# EAGLE design laser-simple (EAGLE 7.2.0)
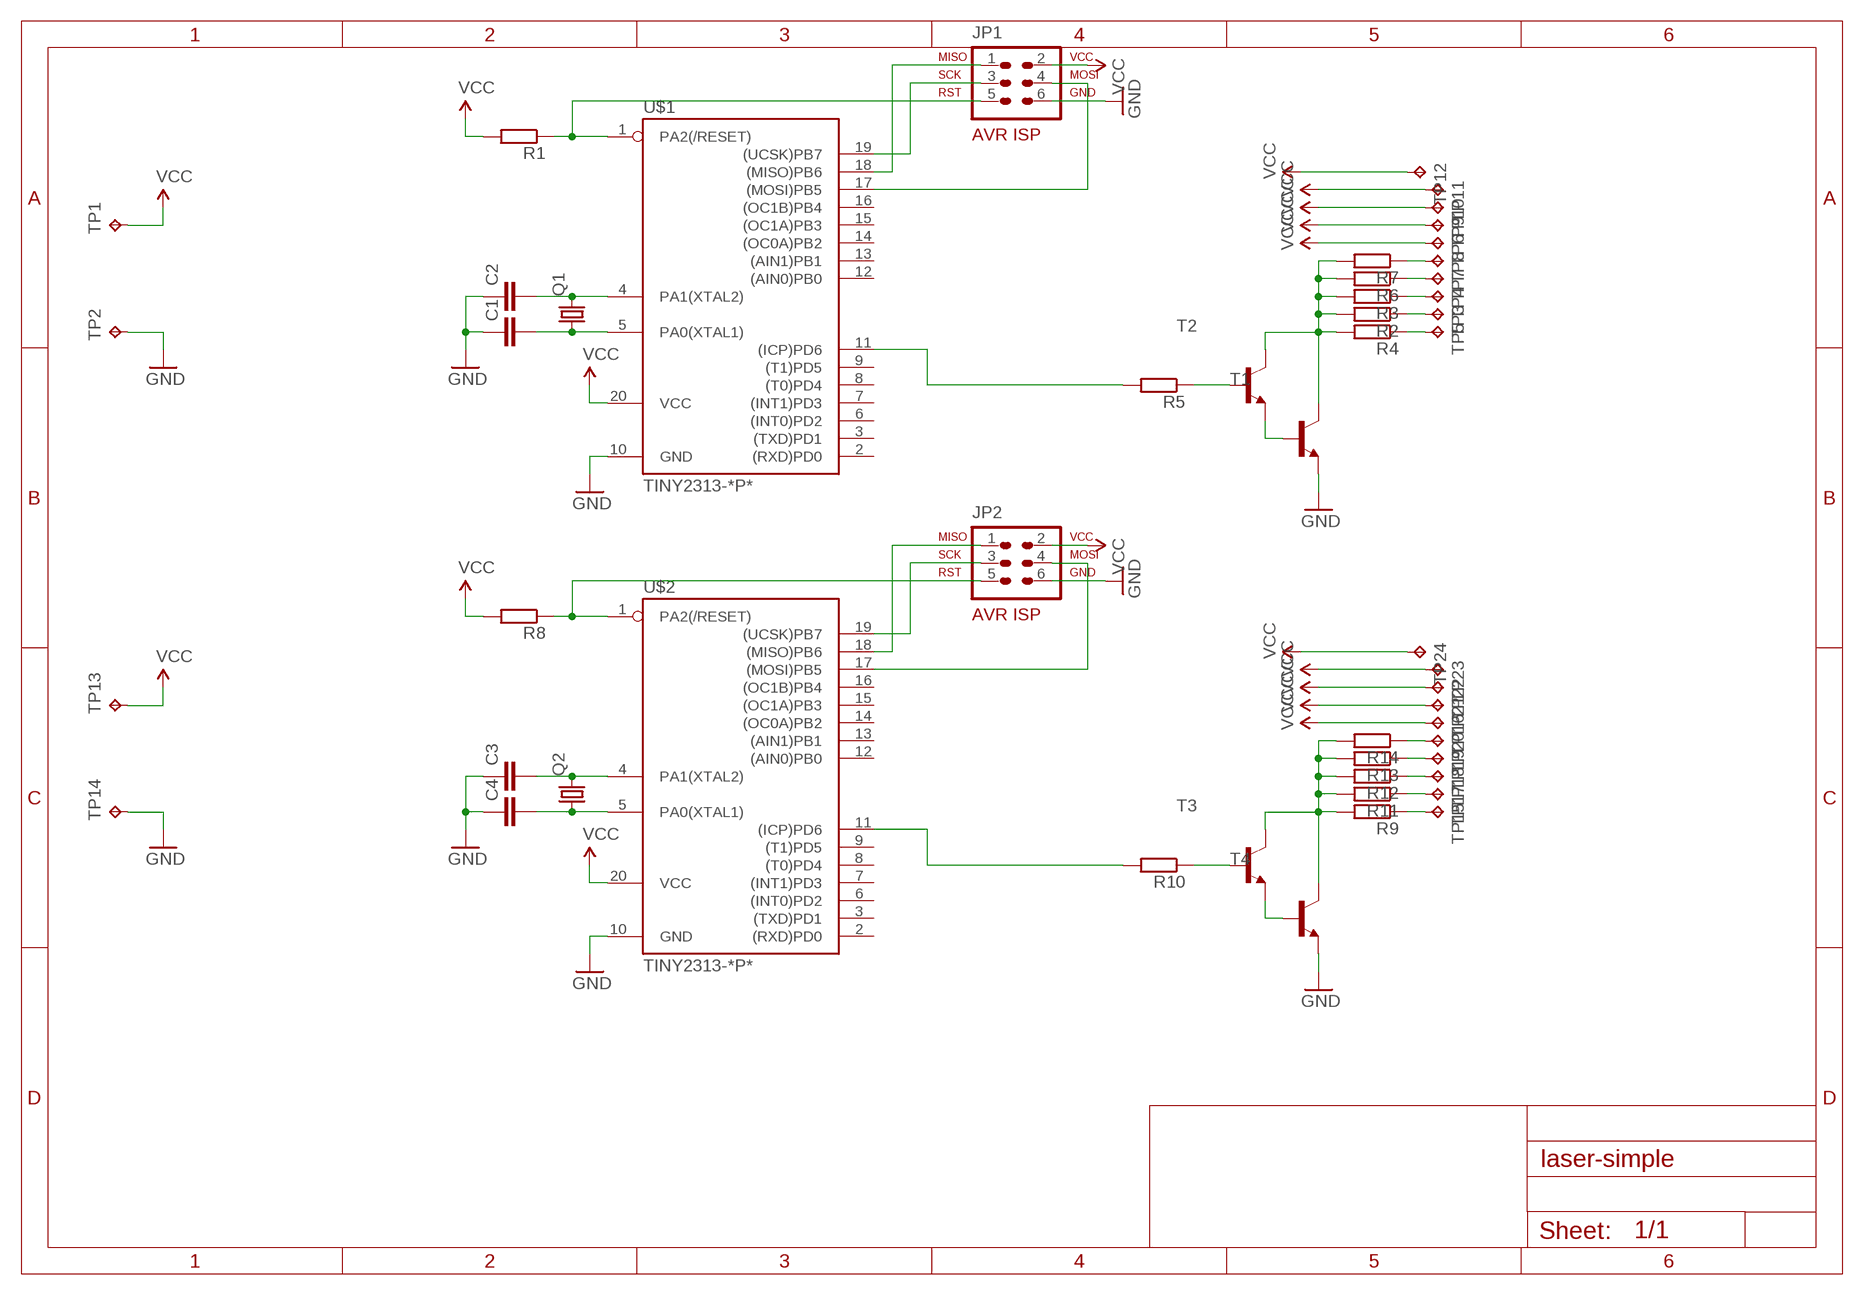
[diagram p0: schematic, sheet 1]

## Parts
C1  C-EU050-024X044  [C050-024X044]
C2  C-EU050-024X044  [C050-024X044]
C3  C-EU050-024X044  [C050-024X044]
C4  C-EU050-024X044  [C050-024X044]
JP1  AVR-ISP-6VERT  [AVR-ISP-6]
JP2  AVR-ISP-6VERT  [AVR-ISP-6]
Q1  CRYSTALHC49U-V  [HC49U-V]
Q2  CRYSTALHC49U-V  [HC49U-V]
R1  R-EU_0207/10  [0207/10]
R2  R-EU_0207/10  [0207/10]
R3  R-EU_0207/10  [0207/10]
R4  R-EU_0207/10  [0207/10]
R5  R-EU_0207/10  [0207/10]
R6  R-EU_0207/10  [0207/10]
R7  R-EU_0207/10  [0207/10]
R8  R-EU_0207/10  [0207/10]
R9  R-EU_0207/10  [0207/10]
R10  R-EU_0207/10  [0207/10]
R11  R-EU_0207/10  [0207/10]
R12  R-EU_0207/10  [0207/10]
R13  R-EU_0207/10  [0207/10]
R14  R-EU_0207/10  [0207/10]
T1  2N1711-NPN-TO39-EBC  [TO39]
T2  2N1711-NPN-TO39-EBC  [TO39]
T3  2N1711-NPN-TO39-EBC  [TO39]
T4  2N1711-NPN-TO39-EBC  [TO39]
TP1  TPPAD1-13Y  [P1-13Y]
TP2  TPPAD1-13Y  [P1-13Y]
TP3  TPPAD1-13Y  [P1-13Y]
TP4  TPPAD1-13Y  [P1-13Y]
TP5  TPPAD1-13Y  [P1-13Y]
TP6  TPPAD1-13Y  [P1-13Y]
TP7  TPPAD1-13Y  [P1-13Y]
TP8  TPPAD1-13Y  [P1-13Y]
TP9  TPPAD1-13Y  [P1-13Y]
TP10  TPPAD1-13Y  [P1-13Y]
TP11  TPPAD1-13Y  [P1-13Y]
TP12  TPPAD1-13Y  [P1-13Y]
TP13  TPPAD1-13Y  [P1-13Y]
TP14  TPPAD1-13Y  [P1-13Y]
TP15  TPPAD1-13Y  [P1-13Y]
TP16  TPPAD1-13Y  [P1-13Y]
TP17  TPPAD1-13Y  [P1-13Y]
TP18  TPPAD1-13Y  [P1-13Y]
TP19  TPPAD1-13Y  [P1-13Y]
TP20  TPPAD1-13Y  [P1-13Y]
TP21  TPPAD1-13Y  [P1-13Y]
TP22  TPPAD1-13Y  [P1-13Y]
TP23  TPPAD1-13Y  [P1-13Y]
TP24  TPPAD1-13Y  [P1-13Y]
U$1  TINY2313-*P*  [DIL20]
U$2  TINY2313-*P*  [DIL20]

## Nets
GND: C1.1 C2.1 C3.1 C4.1 JP1.6 JP2.6 T1.1(E) T4.1(E) TP2.TP TP14.TP U$1.10(GND) U$2.10(GND)
N$1: C2.2 Q1.2 U$1.4(PA1(XTAL2))
N$2: C1.2 Q1.1 U$1.5(PA0(XTAL1))
N$3: JP1.5 R1.1 U$1.1(PA2(/RESET))
N$4: JP1.1 U$1.18((MISO)PB6)
N$5: JP1.3 U$1.19((UCSK)PB7)
N$6: JP1.4 U$1.17((MOSI)PB5)
N$7: T1.2(B) T2.1(E)
N$8: R2.2 R3.2 R4.2 R6.2 R7.2 T1.3(C) T2.3(C)
N$9: R4.1 TP5.TP
N$10: R6.1 TP7.TP
N$11: R3.1 TP4.TP
N$12: R2.1 TP3.TP
N$13: C3.2 Q2.2 U$2.4(PA1(XTAL2))
N$14: R7.1 TP8.TP
N$15: C4.2 Q2.1 U$2.5(PA0(XTAL1))
N$16: R5.1 T2.2(B)
N$17: JP2.5 R8.1 U$2.1(PA2(/RESET))
N$18: JP2.1 U$2.18((MISO)PB6)
N$19: JP2.3 U$2.19((UCSK)PB7)
N$20: JP2.4 U$2.17((MOSI)PB5)
N$21: R5.2 U$1.11((ICP)PD6)
N$22: R9.1 TP15.TP
N$23: R10.1 T3.2(B)
N$24: R10.2 U$2.11((ICP)PD6)
N$25: T3.1(E) T4.2(B)
N$26: R9.2 R11.2 R12.2 R13.2 R14.2 T3.3(C) T4.3(C)
N$27: R13.1 TP19.TP
N$28: R12.1 TP18.TP
N$29: R11.1 TP17.TP
N$30: R14.1 TP20.TP
VCC: JP1.2 JP2.2 R1.2 R8.2 TP1.TP TP6.TP TP9.TP TP10.TP TP11.TP TP12.TP TP13.TP TP16.TP TP21.TP TP22.TP TP23.TP TP24.TP U$1.20(VCC) U$2.20(VCC)
Unconnected: U$1.2((RXD)PD0) U$1.3((TXD)PD1) U$1.6((INT0)PD2) U$1.7((INT1)PD3) U$1.8((T0)PD4) U$1.9((T1)PD5) U$1.12((AIN0)PB0) U$1.13((AIN1)PB1) U$1.14((OC0A)PB2) U$1.15((OC1A)PB3) U$1.16((OC1B)PB4) U$2.2((RXD)PD0) U$2.3((TXD)PD1) U$2.6((INT0)PD2) U$2.7((INT1)PD3) U$2.8((T0)PD4) U$2.9((T1)PD5) U$2.12((AIN0)PB0) U$2.13((AIN1)PB1) U$2.14((OC0A)PB2) U$2.15((OC1A)PB3) U$2.16((OC1B)PB4)

## Library data of the parts
C1-C4 = resistor:C-EU: CAPACITOR, European symbol
JP1 JP2 = avr-7:AVR-ISP-6: AVR ISP-6 Serial Programming Header
Q1 Q2 = crystal:CRYSTAL: CRYSTAL; OC_FARNELL: 1666969; OC_NEWARK: unknown
R1-R14 = resistor:R-EU_: RESISTOR, European symbol
T1-T4 = transistor:*-NPN-: NPN Transistror BF959 corrected 2008.03.06
TP1-TP24 = testpad:TP: Test pad
U$1 U$2 = avr-7:TINY2313*: Atmel Tiny2313 2K Flash, 128 bytes EEPROM, 128 bytes RAM

## Board
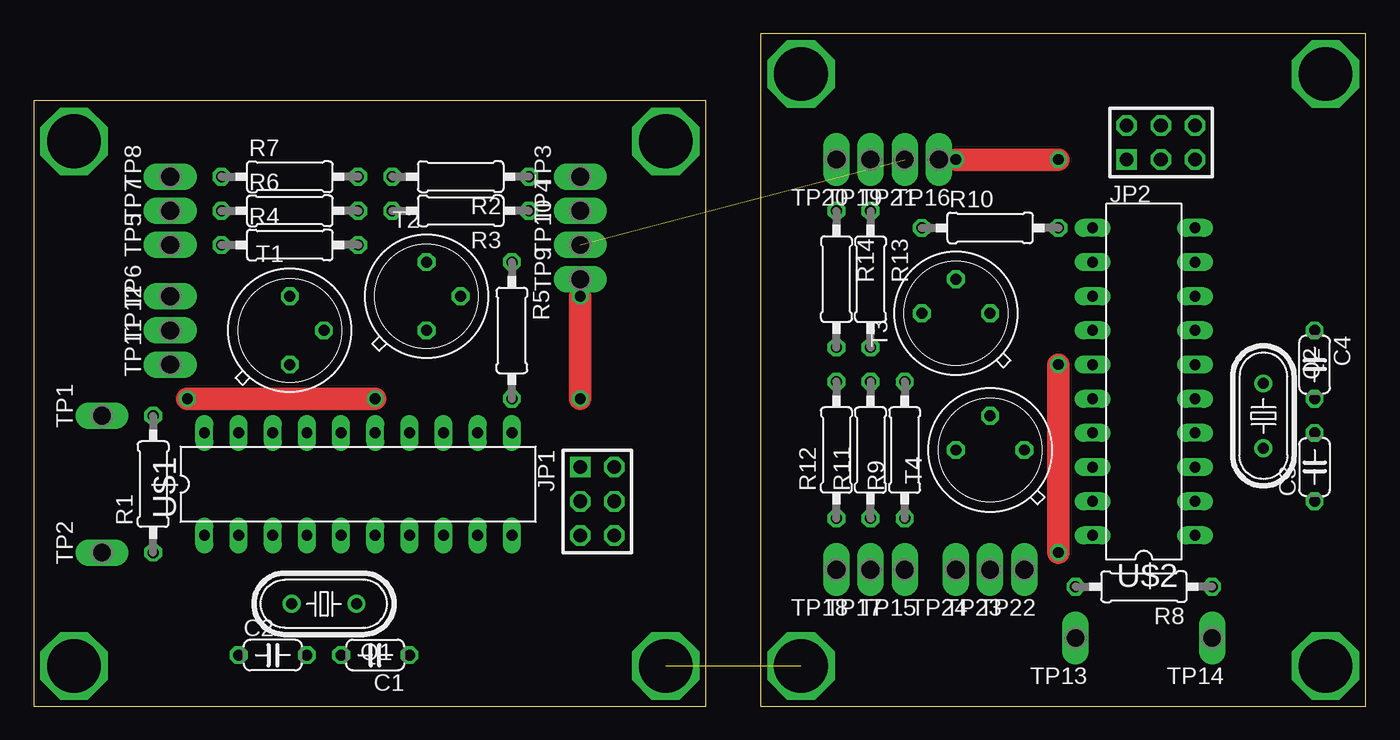
[diagram p1: board, top side]
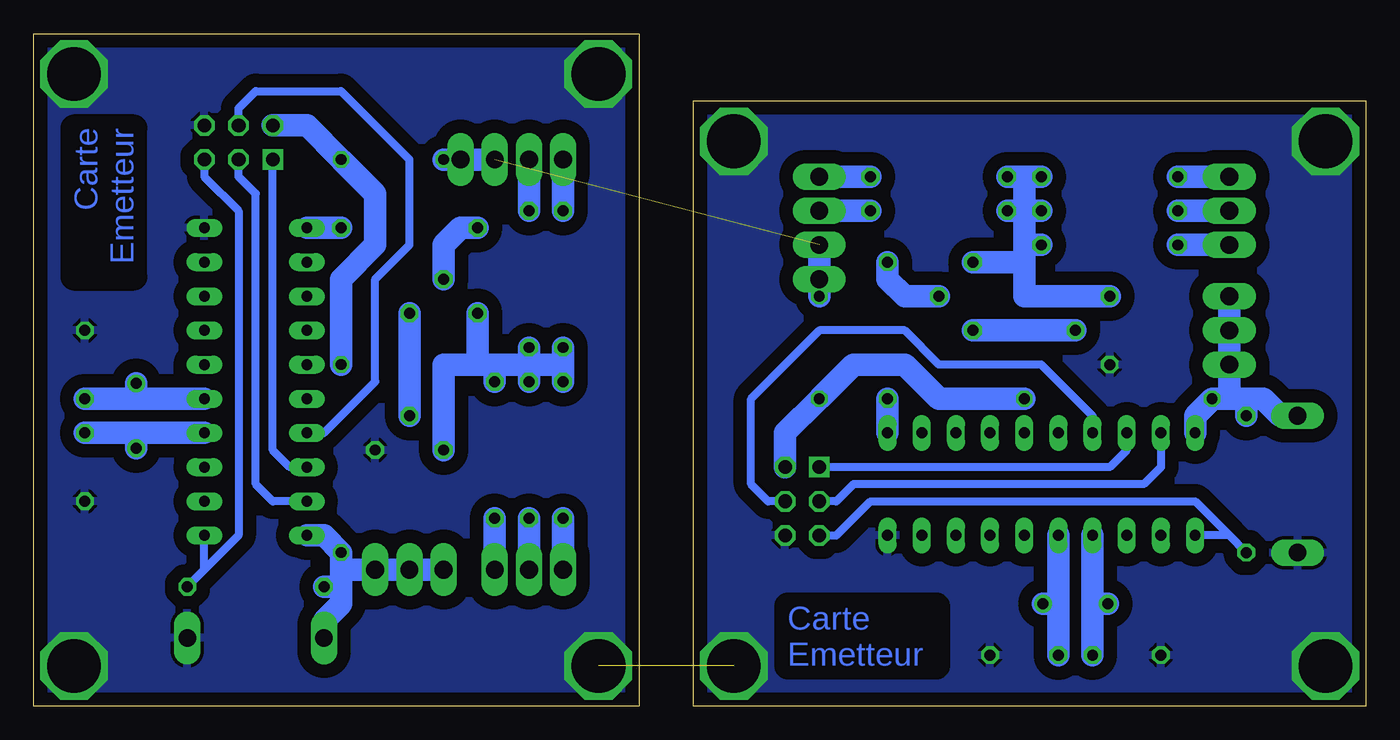
[diagram p2: board, bottom side, seen from below]

Size 99.06 x 50 mm. Coordinates in mm from the lower left corner, seen from the top.
Outline: 0,0 50,0 50,45 0,45 0,0
Outline: 99.06,0 99.06,50 54.06,50 54.06,0 99.06,0
Copper layers (1*16): Top 0.035mm / dielectric 1.5mm / Bottom 0.035mm
Design rules "default": minimum track width 10mil, minimum drill 24mil, track to track 8mil, track to pad 8mil, pad to pad 8mil, via to via 8mil, smd to smd 8mil, copper to edge 40mil, drill to drill 8mil, minimum pad ring 10mil, minimum via ring 8mil, stop-mask expansion 4mil, vias tented up to drill 0mil, thermal gap 10mil

### Footprints (pad centres in the part's own frame; a part is rotated, then mirrored left to right if it is on the bottom)
C050-024X044 = drill 0.813 octagon: 1 -2.54,0; 2 2.54,0
AVR-ISP-6 = drill 1.016 square: 1 -2.54,-1.27 | drill 1.016 octagon: 2 -2.54,1.27; 3 0,-1.27; 4 0,1.27; 5 2.54,-1.27; 6 2.54,1.27
HC49U-V = drill 0.813: 1 -2.413,0; 2 2.413,0
0207/10 = drill 0.813 octagon: 1 -5.08,0; 2 5.08,0
TO39 = drill 0.813 octagon: 1 0,-2.54; 2 2.54,0; 3 0,2.54
P1-13Y = drill 1.321 pad 1.905 long: TP 0,0
DIL20 = drill 0.813 long: 1 -11.43,-3.81; 2 -8.89,-3.81; 3 -6.35,-3.81; 4 -3.81,-3.81; 5 -1.27,-3.81; 6 1.27,-3.81; 7 3.81,-3.81; 8 6.35,-3.81; 9 8.89,-3.81; 10 11.43,-3.81; 11 11.43,3.81; 12 8.89,3.81; 13 6.35,3.81; 14 3.81,3.81; 15 1.27,3.81; 16 -1.27,3.81; 17 -3.81,3.81; 18 -6.35,3.81; 19 -8.89,3.81; 20 -11.43,3.81

### Placement (x,y rotation side)
C1  25.4,3.81 180 top
C2  17.78,3.81 0 top
C3  95.25,17.78 90 top
C4  95.25,25.4 270 top
JP1  41.91,15.24 270 top
JP2  83.82,41.91 0 top
Q1  21.59,7.62 180 top
Q2  91.44,21.59 270 top
R1  8.89,16.51 90 top
R2  31.75,39.37 180 top
R3  31.75,36.83 180 top
R4  19.05,34.29 0 top
R5  35.56,27.94 270 top
R6  19.05,36.83 0 top
R7  19.05,39.37 0 top
R8  82.55,8.89 180 top
R9  64.77,19.05 90 top
R10  71.12,35.56 0 top
R11  62.23,19.05 90 top
R12  59.69,19.05 90 top
R13  62.23,31.75 270 top
R14  59.69,31.75 270 top
T1  19.05,27.94 0 top
T2  29.21,30.48 0 top
T3  68.58,29.21 90 top
T4  71.12,19.05 90 top
TP1  5.08,21.59 90 top
TP2  5.08,11.43 90 top
TP3  40.64,39.37 90 top
TP4  40.64,36.83 90 top
TP5  10.16,34.29 90 top
TP6  10.16,30.48 90 top
TP7  10.16,36.83 90 top
TP8  10.16,39.37 90 top
TP9  40.64,31.75 90 top
TP10  40.64,34.29 90 top
TP11  10.16,25.4 90 top
TP12  10.16,27.94 90 top
TP13  77.47,5.08 180 top
TP14  87.63,5.08 180 top
TP15  64.77,10.16 180 top
TP16  67.31,40.64 180 top
TP17  62.23,10.16 180 top
TP18  59.69,10.16 180 top
TP19  62.23,40.64 180 top
TP20  59.69,40.64 180 top
TP21  64.77,40.64 180 top
TP22  73.66,10.16 180 top
TP23  71.12,10.16 180 top
TP24  68.58,10.16 180 top
U$1  24.13,16.51 0 top
U$2  82.55,24.13 90 top

### Tracks (layer width: path | path; a pad name or v marks a point on that pad's centre or on a via)
GND  (via drill 4)  (1 unrouted)
  other vias: 3,42 47,42 47,3 3,3 57.06,3 57.06,47 96.06,47 96.06,3
  pour Bottom (isolate 1): 0,0 50,0 50,45 0,45
  pour Bottom (isolate 1): 99.06,0 99.06,50 54.06,50 54.06,0
N$1
  Bottom 1.676: U$1.4 20.32,7.62 | 20.32,7.62 C2.2 | Q1.2 20.32,7.62
N$2
  Bottom 1.676: U$1.5 22.86,7.62 | 22.86,7.62 C1.2 | Q1.1 22.86,7.62
N$3
  Bottom 0.61: JP1.5 39.37,12.7 36.83,15.24 12.7,15.24 10.16,12.7 | 10.16,12.7 U$1.1 | R1.1 10.16,12.7
N$4
  Bottom 0.61: U$1.18 17.78,19.05 19.05,17.78 JP1.1
N$5
  Bottom 0.61: U$1.19 15.24,17.78 16.51,16.51 38.1,16.51 39.37,15.24 JP1.3
N$6
  Bottom 0.61: U$1.17 20.32,21.59 24.13,25.4 31.75,25.4 34.29,27.94 40.64,27.94 45.72,22.86 45.72,16.51 44.45,15.24 JP1.4
N$7
  Bottom 1.676: T2.1 T1.2
N$8
  Bottom 1.676: R2.2 25.4,39.37 | 25.4,39.37 R7.2 | R6.2 25.4,36.83 | 25.4,36.83 25.4,39.37 | R3.2 25.4,36.83 | R4.2 25.4,34.29 | 25.4,34.29 25.4,36.83 | 25.4,34.29 25.4,33.02 | 25.4,33.02 25.4,30.48 T1.3 | T2.3 25.4,33.02
N$9
  Bottom 1.676: R4.1 TP5.TP
N$10
  Bottom 1.676: R6.1 TP7.TP
N$11
  Bottom 1.676: TP4.TP R3.1
N$12
  Bottom 1.676: TP3.TP R2.1
N$13
  Bottom 1.676: U$2.4 91.44,20.32 | 91.44,20.32 C3.2 | Q2.2 91.44,20.32
N$14
  Bottom 1.676: R7.1 TP8.TP
N$15
  Bottom 1.676: U$2.5 91.44,22.86 | 91.44,22.86 C4.2 | Q2.1 91.44,22.86
N$16
  Bottom 1.676: R5.1 35.56,31.75 34.29,30.48 T2.2
N$17
  Bottom 0.61: JP2.5 86.36,39.37 83.82,36.83 83.82,12.7 86.36,10.16 | 86.36,10.16 U$2.1 | R8.1 86.36,10.16
N$18
  Bottom 0.61: U$2.18 80.01,17.78 81.28,19.05 JP2.1
N$19
  Bottom 0.61: U$2.19 81.28,15.24 82.55,16.51 82.55,38.1 83.82,39.37 JP2.3
N$20
  Bottom 0.61: U$2.17 77.47,20.32 73.66,24.13 73.66,31.75 71.12,34.29 71.12,40.64 76.2,45.72 82.55,45.72 83.82,44.45 JP2.4
N$21
  Bottom 1.676: U$1.11 R5.2
N$22
  Bottom 1.676: R9.1 TP15.TP
N$23
  Bottom 1.676: R10.1 67.31,35.56 68.58,34.29 T3.2
N$24
  Bottom 1.676: U$2.11 R10.2
N$25
  Bottom 1.676: T3.1 T4.2
N$26
  Bottom 1.676: R14.2 59.69,25.4 | 59.69,25.4 R12.2 | R11.2 62.23,25.4 | 62.23,25.4 59.69,25.4 | R13.2 62.23,25.4 | R9.2 64.77,25.4 | 64.77,25.4 62.23,25.4 | 64.77,25.4 66.04,25.4 | 66.04,25.4 68.58,25.4 T4.3 | T3.3 66.04,25.4
N$27
  Bottom 1.676: TP19.TP R13.1
N$28
  Bottom 1.676: R12.1 TP18.TP
N$29
  Bottom 1.676: R11.1 TP17.TP
N$30
  Bottom 1.676: TP20.TP R14.1
VCC  (via drill 0.8)  (1 unrouted)
  Top 1.676: v40.64,30.48 v40.64,22.86 | v25.4,22.86 v11.43,22.86 | v68.58,40.64 v76.2,40.64 | v76.2,25.4 v76.2,11.43
  Bottom 1.676: TP1.TP 6.35,21.59 7.62,22.86 8.89,22.86 | TP6.TP TP12.TP TP11.TP 10.16,22.86 | U$1.20 12.7,21.59 v11.43,22.86 10.16,22.86 | 10.16,22.86 8.89,22.86 | R1.2 8.89,22.86 | TP10.TP TP9.TP v40.64,30.48 | JP1.2 43.18,20.32 v40.64,22.86 38.1,25.4 34.29,25.4 31.75,22.86 v25.4,22.86 | TP13.TP 77.47,6.35 76.2,7.62 76.2,8.89 | TP24.TP TP23.TP TP22.TP 76.2,10.16 | U$2.20 77.47,12.7 v76.2,11.43 76.2,10.16 | 76.2,10.16 76.2,8.89 | R8.2 76.2,8.89 | TP21.TP TP16.TP v68.58,40.64 | JP2.2 78.74,43.18 v76.2,40.64 73.66,38.1 73.66,34.29 76.2,31.75 v76.2,25.4

### Text on the board
Bottom: Carte / Emetteur | Carte / Emetteur